# EAGLE design murdock_top (EAGLE 6.2)
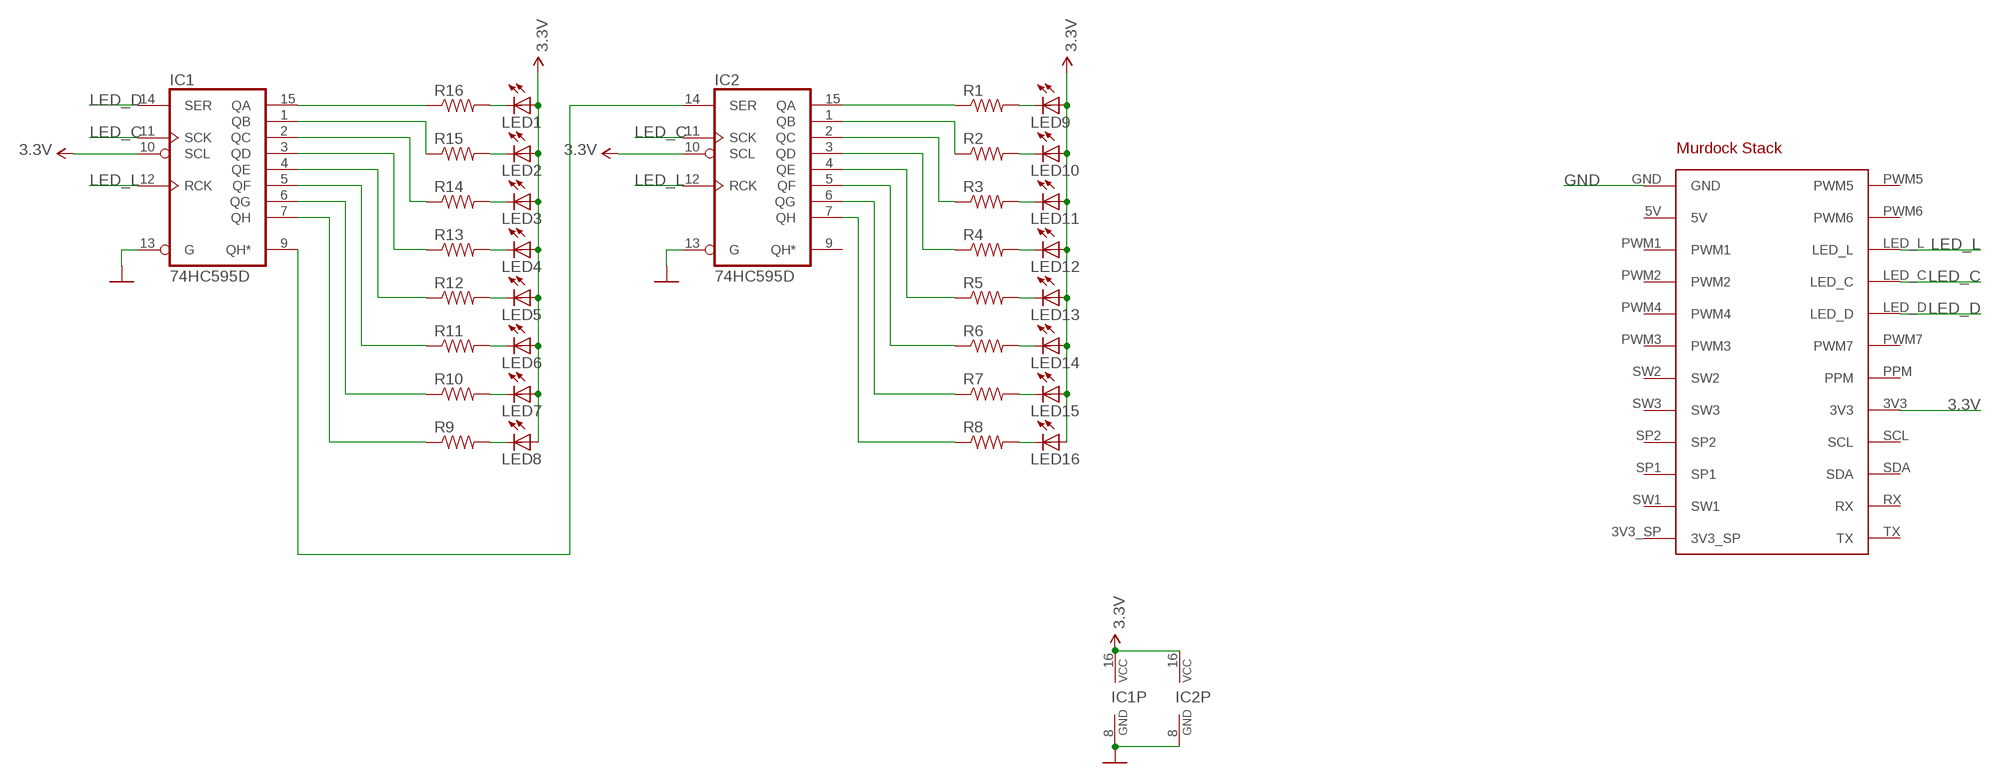
[diagram p0: schematic, sheet 1]

## Parts
IC1  74HC595D  [SO16]
IC2  74HC595D  [SO16]
LED1  LGM47K  [LGM47K]
LED2  LGM47K  [LGM47K]
LED3  LGM47K  [LGM47K]
LED4  LGM47K  [LGM47K]
LED5  LGM47K  [LGM47K]
LED6  LGM47K  [LGM47K]
LED7  LGM47K  [LGM47K]
LED8  LGM47K  [LGM47K]
LED9  LGM47K  [LGM47K]
LED10  LGM47K  [LGM47K]
LED11  LGM47K  [LGM47K]
LED12  LGM47K  [LGM47K]
LED13  LGM47K  [LGM47K]
LED14  LGM47K  [LGM47K]
LED15  LGM47K  [LGM47K]
LED16  LGM47K  [LGM47K]
R1  RESISTOR0402-RES  [0402-RES]
R2  RESISTOR0402-RES  [0402-RES]
R3  RESISTOR0402-RES  [0402-RES]
R4  RESISTOR0402-RES  [0402-RES]
R5  RESISTOR0402-RES  [0402-RES]
R6  RESISTOR0402-RES  [0402-RES]
R7  RESISTOR0402-RES  [0402-RES]
R8  RESISTOR0402-RES  [0402-RES]
R9  RESISTOR0402-RES  [0402-RES]
R10  RESISTOR0402-RES  [0402-RES]
R11  RESISTOR0402-RES  [0402-RES]
R12  RESISTOR0402-RES  [0402-RES]
R13  RESISTOR0402-RES  [0402-RES]
R14  RESISTOR0402-RES  [0402-RES]
R15  RESISTOR0402-RES  [0402-RES]
R16  RESISTOR0402-RES  [0402-RES]
X1  MURDOCK_STACK  [MURDOCK_STACK]

## Nets
3.3V: IC1.10(SCL) IC1.16(VCC) IC2.10(SCL) IC2.16(VCC) LED1.A LED2.A LED3.A LED4.A LED5.A LED6.A LED7.A LED8.A LED9.A LED10.A LED11.A LED12.A LED13.A LED14.A LED15.A LED16.A X1.3V3
GND: IC1.8(GND) IC1.13(G) IC2.8(GND) IC2.13(G) X1.GND
LED_C: IC1.11(SCK) IC2.11(SCK) X1.LED_C
LED_D: IC1.14(SER) X1.LED_D
LED_L: IC1.12(RCK) IC2.12(RCK) X1.LED_L
N$1: IC1.9(QH*) IC2.14(SER)
N$2: LED9.K(C) R1.2
N$3: LED10.K(C) R2.2
N$4: LED11.K(C) R3.2
N$5: LED12.K(C) R4.2
N$6: LED13.K(C) R5.2
N$7: LED14.K(C) R6.2
N$8: LED15.K(C) R7.2
N$9: LED16.K(C) R8.2
N$10: LED1.K(C) R16.2
N$11: LED2.K(C) R15.2
N$12: LED3.K(C) R14.2
N$13: LED4.K(C) R13.2
N$14: LED5.K(C) R12.2
N$15: LED6.K(C) R11.2
N$16: LED7.K(C) R10.2
N$17: LED8.K(C) R9.2
Q0: IC2.15(QA) R1.1
Q1: IC2.1(QB) R2.1
Q2: IC2.2(QC) R3.1
Q3: IC2.3(QD) R4.1
Q4: IC2.4(QE) R5.1
Q5: IC2.5(QF) R6.1
Q6: IC2.6(QG) R7.1
Q7: IC2.7(QH) R8.1
QA: IC1.15(QA) R16.1
QB: IC1.1(QB) R15.1
QC: IC1.2(QC) R14.1
QD: IC1.3(QD) R13.1
QE: IC1.4(QE) R12.1
QF: IC1.5(QF) R11.1
QG: IC1.6(QG) R10.1
QH: IC1.7(QH) R9.1
Unconnected: IC2.9(QH*) X1.3V3_SP X1.5V X1.PPM X1.PWM1 X1.PWM2 X1.PWM3 X1.PWM4 X1.PWM5 X1.PWM6 X1.PWM7 X1.RX X1.SCL X1.SDA X1.SP1 X1.SP2 X1.SW1 X1.SW2 X1.SW3 X1.TX

## Library data of the parts
IC1 IC2 = 74xx-eu:74*595: 8-bit SHIFT REGISTER, output latch
LED1-LED16 = seb:LGM47K
R1-R16 = SparkFun-Passives:RESISTOR: Resistor Basic schematic elements and footprints for 0603, 1206, and PTH resistors.
X1 = murdock:MURDOCK_STACK

## Board
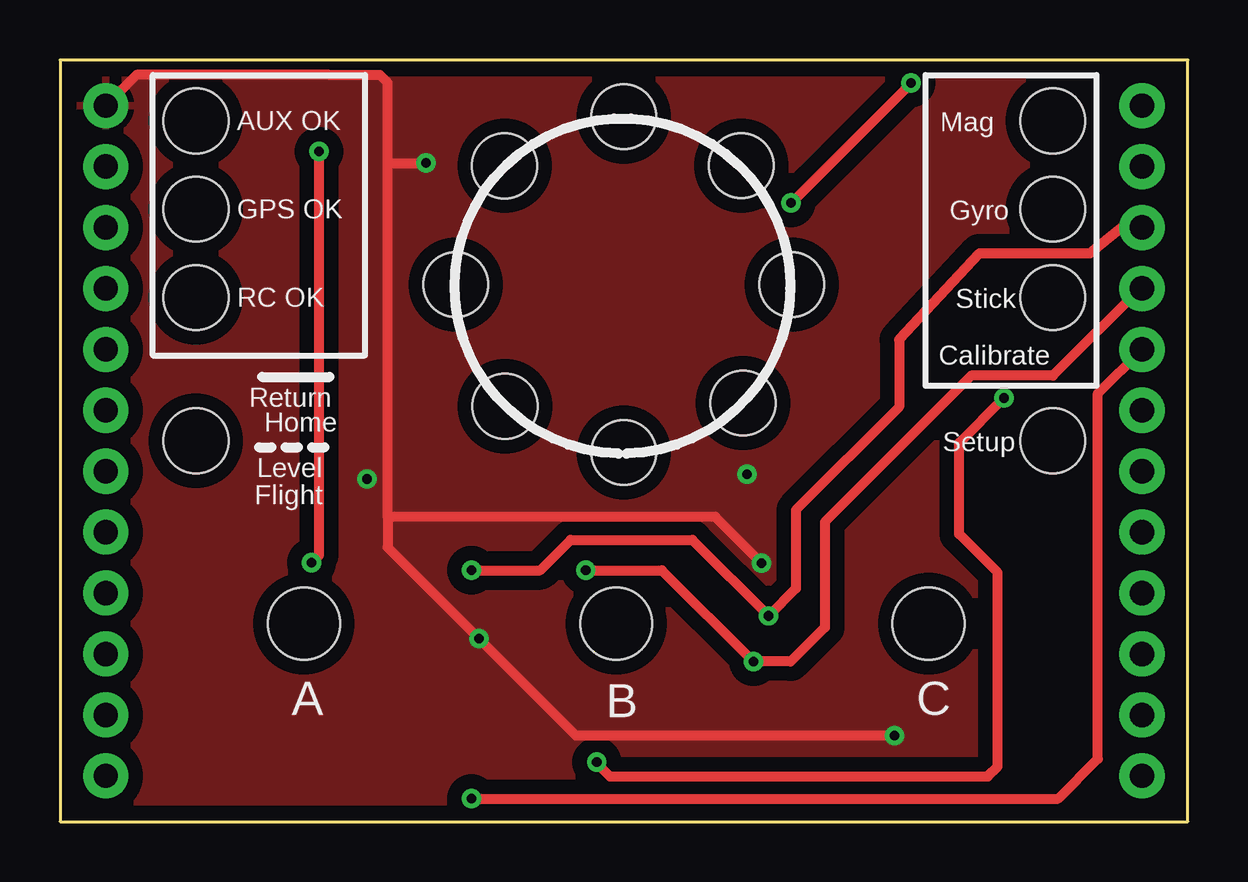
[diagram p1: board, top side]
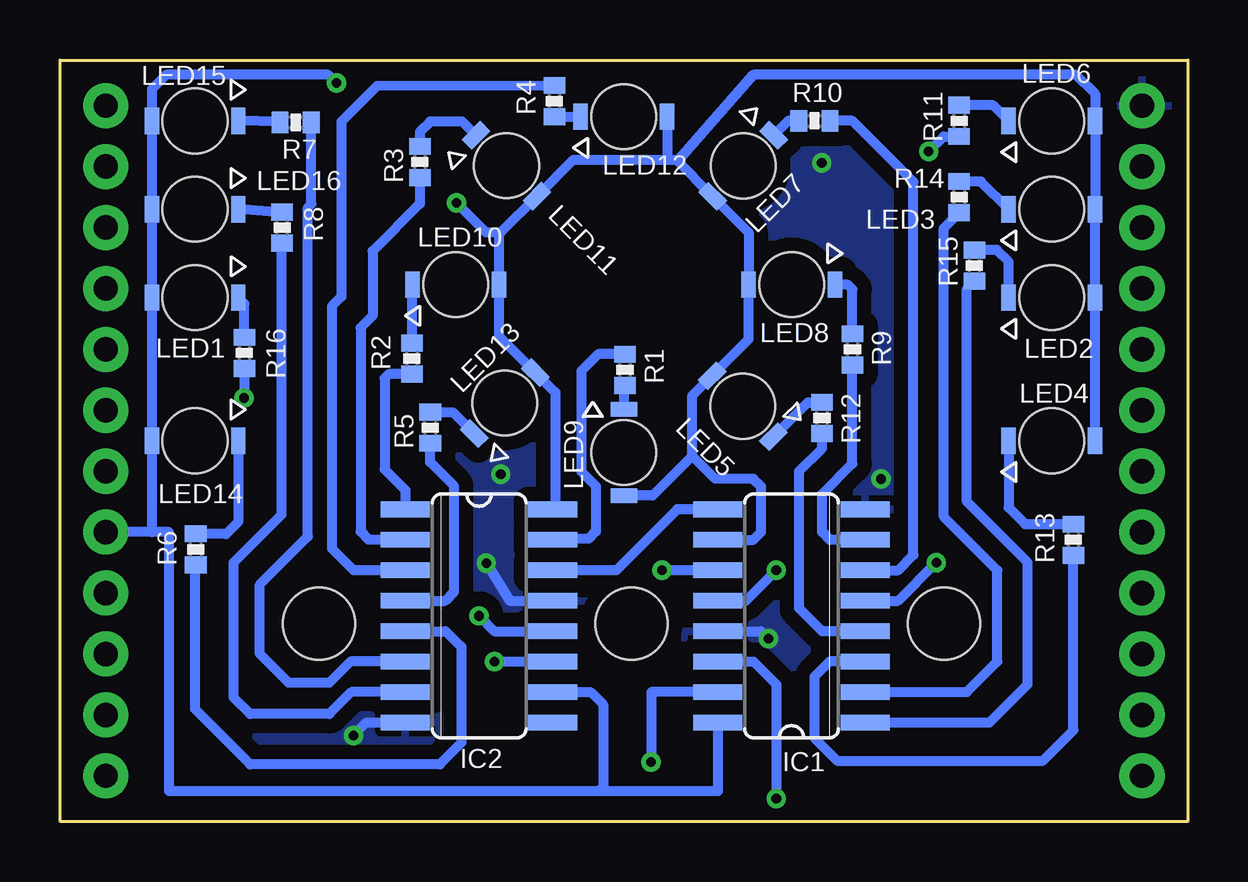
[diagram p2: board, bottom side, seen from below]

Size 46.99 x 31.75 mm. Coordinates in mm from the lower left corner, seen from the top.
Copper layers (1*16): Top 0.035mm / dielectric 1.5mm / Bottom 0.035mm
Design rules: minimum track width 10mil, minimum drill 0.4mm, track to track 8mil, track to pad 8mil, pad to pad 8mil, via to via 8mil, smd to smd 8mil, copper to edge 8mil, drill to drill 8mil, minimum pad ring 10mil, minimum via ring 8mil, stop-mask expansion 4mil, vias tented up to drill 30mil, thermal gap 10mil
Holes 3 mm at 36.2,8.26 23.18,8.26 10.16,8.26

### Footprints (pad centres in the part's own frame; a part is rotated, then mirrored left to right if it is on the bottom)
SO16 = smd 0.66 x 2.032: 1 -4.445,-3.073; 2 -3.175,-3.073; 3 -1.905,-3.073; 4 -0.635,-3.073; 5 0.635,-3.073; 6 1.905,-3.073; 7 3.175,-3.073; 8 4.445,-3.073; 9 4.445,3.073; 10 3.175,3.073; 11 1.905,3.073; 12 0.635,3.073; 13 -0.635,3.073; 14 -1.905,3.073; 15 -3.175,3.073; 16 -4.445,3.073
LGM47K = smd 0.6 x 1.1: A -1.8,0; K 1.8,0 | hole 2.7: 0,0
0402-RES = smd 0.7 x 0.9: 1 -0.65,0; 2 0.65,0
MURDOCK_STACK = drill 1.016 pad 1.88: 3V3 19.685,45.085; 3V3_SP 29.845,1.905; 5V 4.445,1.905; GND 1.905,1.905; LED_C 9.525,45.085; LED_D 12.065,45.085; LED_L 6.985,45.085; PPM 17.145,45.085; PWM1 6.985,1.905; PWM2 9.525,1.905; PWM3 14.605,1.905; PWM4 12.065,1.905; PWM5 1.905,45.085; PWM6 4.445,45.085; PWM7 14.605,45.085; RX 29.845,45.085; SCL 22.225,45.085; SDA 24.765,45.085; SP1 24.765,1.905; SP2 22.225,1.905; SW1 27.305,1.905; SW2 17.145,1.905; SW3 19.685,1.905; TX 27.305,45.085

### Placement (x,y rotation side)
IC1  16.51,8.57 90 bottom
IC2  29.53,8.57 270 bottom
LED1  41.37,21.84 0 bottom
LED2  5.67,21.84 180 bottom
LED3  5.67,25.53 180 bottom
LED4  5.67,15.88 180 bottom
LED5  18.54,17.31 315 bottom
LED6  5.67,29.21 180 bottom
LED7  18.52,27.34 45 bottom
LED8  16.5,22.39 0 bottom
LED9  23.5,15.38 90 bottom
LED10  30.5,22.39 180 bottom
LED11  28.39,27.34 135 bottom
LED12  23.5,29.39 180 bottom
LED13  28.46,17.45 225 bottom
LED14  41.37,15.88 0 bottom
LED15  41.37,29.21 0 bottom
LED16  41.37,25.53 0 bottom
R1  23.45,18.83 270 bottom
R2  32.33,19.3 90 bottom
R3  32,27.5 90 bottom
R4  26.39,30.04 270 bottom
R5  31.57,16.42 90 bottom
R6  41.34,11.35 90 bottom
R7  37.17,29.14 180 bottom
R8  37.73,24.76 90 bottom
R9  13.97,19.68 90 bottom
R10  15.56,29.21 180 bottom
R11  9.53,29.21 90 bottom
R12  15.24,16.83 90 bottom
R13  4.76,11.75 90 bottom
R14  9.53,26.04 90 bottom
R15  8.89,23.18 90 bottom
R16  39.3,19.54 90 bottom
X1  0,31.75 270 top

### Tracks (layer width: path | path; a pad name or v marks a point on that pad's centre or on a via)
3.3V  (via drill 0.4)
  Top 0.406: v30.46,25.79 v35.47,30.79
  Bottom 0.406: 43.16,12.06 42.44,12.06 42.44,1.27 24.57,1.27 | 43.16,12.06 X1.3V3 | IC1.16 19.58,1.27 24.57,1.27 | IC1.10 18.1,11.75 17.78,12.06 17.78,13.97 18.1,14.29 19.68,14.29 20.64,15.24 | 20.64,15.24 20.64,17.76 LED5.A 18.3,20.11 LED8.A 18.3,24.56 LED7.A 21.32,27.59 | IC2.10 24.88,5.4 24.36,4.88 24.36,1.47 24.57,1.27 | v35.47,30.79 35.81,31.14 42.56,31.14 43.16,30.54 LED15.A LED16.A LED1.A LED14.A 43.16,12.06 | 21.32,27.59 21.21,27.59 18.11,31.14 4.67,31.14 3.87,30.34 LED6.A LED3.A LED2.A LED4.A | 20.64,15.24 22.29,13.59 LED9.A | 28.62,24.57 28.7,24.49 LED10.A 28.7,20.23 LED13.A 26.35,17.89 26.35,13.12 IC2.16 | 28.62,24.57 LED11.A 25.6,27.59 21.7,27.59 | 21.7,27.59 21.32,27.59 | LED12.A 21.7,27.59 | v30.46,25.79 29.25,24.57 28.62,24.57
GND  (via drill 0.4)
  Top 0.406: 15.4,27.45 v15.25,27.45 13.65,27.45 | X1.GND 3.19,31.14 11.22,31.14 11.24,31.11 13.34,31.11 13.65,30.8 13.65,27.45 | v29.23,10.78 27.3,12.7 13.65,12.7 | 13.65,12.7 13.65,11.43 v17.46,7.62 21.5,3.58 v34.77,3.58 | 13.65,12.7 13.65,27.45
  Bottom 0.406: IC1.13 17.78,7.94 v17.46,7.62 | v29.23,10.78 28.26,9.21 IC2.13 | IC1.8 12.7,13.02 | v34.77,3.58 34.22,4.13 IC2.8
  other vias: 28.63,14.48 12.79,14.28
  pour Top (isolate 0.61): -0.64,32.38 -0.64,-0.64 47.31,-0.64 47.31,32.38
  pour Bottom (isolate 0.61): -0.64,32.38 -0.64,-0.64 47.31,-0.64 47.31,32.38
LED_C  (via drill 0.4)
  Top 0.406: v21.91,10.48 25.08,10.48 v28.89,6.67 30.45,6.67 31.86,8.09 31.86,12.48 37.97,18.59 41.37,18.59 45.01,22.23 X1.LED_C
  Bottom 0.406: IC1.11 v21.91,10.48 | v28.89,6.67 IC2.11
LED_D  (via drill 0.4)
  Top 0.406: v17.14,0.95 41.59,0.95 43.24,2.6 43.24,17.84 X1.LED_D
  Bottom 0.406: IC1.14 18.1,6.67 17.14,5.71 v17.14,0.95
LED_L  (via drill 0.4)
  Top 0.406: X1.LED_L 44.24,24.77 42.91,23.69 38.31,23.69 34.97,20.09 34.97,17.29 30.66,12.98 30.66,9.71 v29.53,8.57 26.35,11.75 21.27,11.75 20,10.48 v17.14,10.48
  Bottom 0.406: IC1.12 18.41,9.21 v17.14,10.48 | v29.53,8.57 28.89,7.94 IC2.12
N$1
  Bottom 0.406: IC1.9 21.27,13.02 23.81,10.48 IC2.14
N$2
  Bottom 0.406: R1.2 23.5,18.13 LED9.K
N$3
  Bottom 0.406: LED10.K 32.33,22.36 R2.2
N$4
  Bottom 0.406: LED11.K 30.23,29.18 31.57,29.18 32,28.75 R3.2
N$5
  Bottom 0.406: R4.2 LED12.K
N$6
  Bottom 0.406: R5.2 30.63,17.07 LED13.K
N$7
  Bottom 0.406: LED14.K 39.56,12.48 40.06,11.98 41.32,11.98 R6.2
N$8
  Bottom 0.406: R7.2 37.86,29.18 LED15.K
N$9
  Bottom 0.406: R8.2 37.76,25.39 LED16.K
N$10
  Bottom 0.406: R16.2 39.3,21.58 LED1.K
N$11
  Bottom 0.406: LED2.K 7.46,23.34 7.95,23.83 R15.2
N$12
  Bottom 0.406: LED3.K 8.62,26.68 R14.2
N$13
  Bottom 0.406: LED4.K 7.46,13.09 6.78,12.4 R13.2
N$14
  Bottom 0.406: LED5.K 15.83,17.48 R12.2
N$15
  Bottom 0.406: LED6.K 8.12,29.86 R11.2
N$16
  Bottom 0.406: R10.2 16.65,29.21 LED7.K
N$17
  Bottom 0.406: R9.2 13.97,22.19 14.16,22.39 LED8.K
Q0
  Bottom 0.406: R1.1 24.57,19.48 25.27,18.79 25.27,14.59 24.66,13.98 24.66,12.09 24.96,11.79 26.42,11.79 IC2.15
Q1
  Bottom 0.406: R2.1 33.3,18.65 33.47,18.48 33.47,14.69 32.6,13.82 IC2.1
Q2
  Bottom 0.406: IC2.2 34.13,11.75 34.47,12.09 34.47,20.59 33.97,21.09 33.97,23.79 32,25.75 R3.1
Q3
  Bottom 0.406: IC2.3 34.76,10.48 35.66,11.38 35.66,21.48 35.27,21.89 35.27,29.18 33.79,30.66 R4.1
Q4
  Bottom 0.406: IC2.4 30.94,9.21 30.57,9.59 30.57,13.98 31.57,14.98 R5.1
Q5
  Bottom 0.406: IC2.5 30.92,7.94 30.27,7.29 30.27,3.29 31.16,2.38 39.06,2.38 41.37,4.68 41.37,10.67 R6.1
Q6
  Bottom 0.406: IC2.6 34.88,6.67 35.77,5.79 37.47,5.79 38.66,6.99 38.66,9.88 36.66,11.88 36.66,25.6 36.52,25.75 R7.1
Q7
  Bottom 0.406: IC2.7 34.85,5.4 35.77,4.49 39.06,4.49 39.77,5.18 39.77,10.79 37.77,12.79 37.77,24.08 R8.1
QA  (via drill 0.4)
  Top 0.406: v22.36,2.48 22.32,2.48 22.91,1.89 38.66,1.89 39.06,2.29 39.06,10.38 37.47,11.98 37.47,15.79 v39.33,17.66
  Bottom 0.406: IC1.15 22.35,5.4 v22.36,2.48 | R16.1 39.3,17.68 v39.33,17.66
QB
  Bottom 0.406: IC1.1 8.26,4.13 6.67,5.71 6.67,10.79 9.21,13.34 9.21,22.21 R15.1
QC
  Bottom 0.406: IC1.2 9.21,5.4 7.94,6.67 7.94,10.48 10.16,12.7 10.16,24.75 R14.1
QD
  Bottom 0.406: IC1.3 14.92,6.67 15.56,6.03 15.56,3.49 14.61,2.54 6.03,2.54 4.76,3.81 R13.1
QE
  Bottom 0.406: IC1.4 15.24,7.94 16.19,8.89 16.19,14.61 15.24,15.56 R12.1
QF  (via drill 0.4)
  Top 0.406: v10.79,27.94 10.79,11.11 v10.48,10.79
  Bottom 0.406: IC1.5 12.06,9.21 v10.48,10.79 | v10.79,27.94 10.18,28.56 R11.1
QG
  Bottom 0.406: IC1.6 12.06,10.48 11.43,11.11 11.43,26.67 13.97,29.21 R10.1
QH
  Bottom 0.406: IC1.7 14.92,11.75 15.24,12.06 15.24,13.65 13.97,14.92 R9.1

### Text on the board
tPlace: Mag | AUX OK | Gyro | GPS OK | Stick | RC OK | Calibrate | Return | Home | Setup | Level | Flight | A | B | C